# Altium schematic sheet RS232 MAX3222EEWN.SchDoc
size 90 x 90 mm
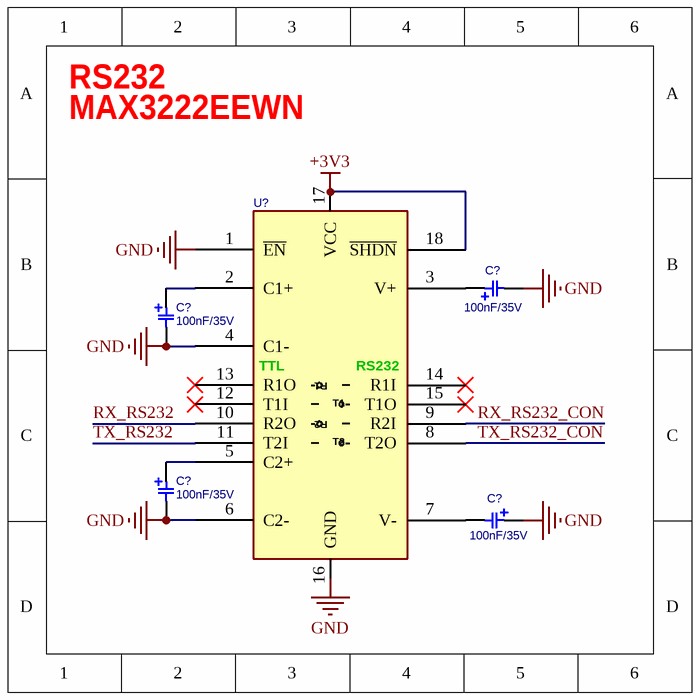
[diagram p0: RS232 MAX3222EEWN.SchDoc]

## Parts
(Parts that share a designator on the sheet are numbered #1, #2 ... from top to bottom, then left to right.)
C?#1  100nF/35V  [C_TN_3216]
C?#2  100nF/35V  [C_TN_3216]
C?#3  100nF/35V  [C_TN_3216]
C?#4  100nF/35V  [C_TN_3216]
U?  (no value)  [SO_18]

## Nets
+3V3: U?.17(VCC) U?.18(~{SHDN})
GND: C?#1.2 C?#2.2 C?#3.2 C?#4.1 U?.1(~{EN}) U?.4(C1-) U?.6(C2-) U?.16(GND)
RX_RS232: U?.10(R2O)
RX_RS232_CON: U?.9(R2I)
TX_RS232: U?.11(T2I)
TX_RS232_CON: U?.8(T2O)
NetC?#1_1: C?#1.1 U?.3(V+)
NetC?#2_1: C?#2.1 U?.2(C1+)
NetC?#3_1: C?#3.1 U?.5(C2+)
NetC?#4_2: C?#4.2 U?.7(V-)

Not connected (* = marked no-connect by the designer): U? 12(T1I)* 13(R1O)* 14(R1I)* 15(T1O)*

## Notes on the sheet
- MAX3222EEWN
- RS232
- (in symbol RS232_MAX3222_SOP18W) TTL; RS232; R1; T1; R2; T2

## Library data of the parts
C?#1-C?#4 = CAP_SMD_TAN: CAP, SMD, TAN; PARAM: 10V; VALUE: 100nF/35V
U? = RS232_MAX3222_SOP18W: RS-232, DUAL, +3~5V, Driver/Receiver, Low-Power, up to 1Mbps, Using Four 0.1µF External Capacitor; MANF_PART#: MAX3232ECWE+; MANF: Maxim Integrated; PARAM2: +3~5.5V; PARAM: PARAM